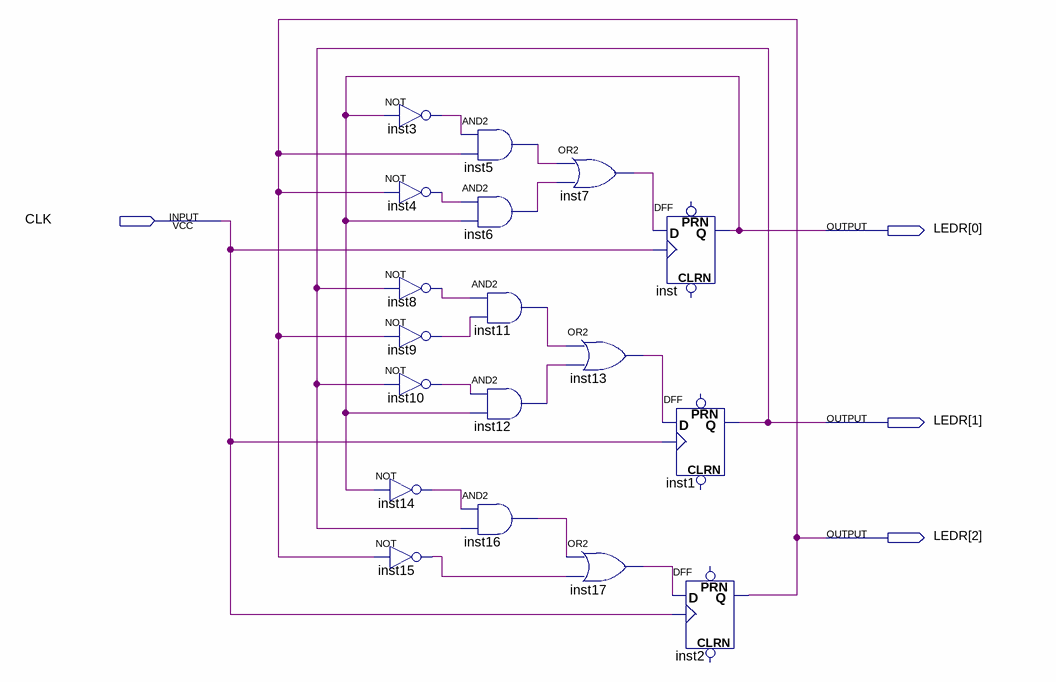
[diagram p0: schematic sheet]
// Quartus schematic lab22.bdf as structural Verilog: 18 symbols, 4 pins
module lab22 (
  input  CLK,
  output [2:0] LEDR
);

  wire inst3_out, inst4_out, inst5_out, inst6_out, inst7_out, inst8_out, inst9_out, inst10_out, inst11_out,
       inst12_out, inst13_out, inst14_out, inst15_out, inst16_out, inst17_out;

  not inst3 (inst3_out, LEDR[0]);
  not inst4 (inst4_out, LEDR[2]);
  not inst8 (inst8_out, LEDR[1]);
  not inst9 (inst9_out, LEDR[2]);
  not inst10 (inst10_out, LEDR[1]);
  not inst14 (inst14_out, LEDR[0]);
  not inst15 (inst15_out, LEDR[2]);
  and inst5 (inst5_out, inst3_out, LEDR[2]);
  and inst6 (inst6_out, inst4_out, LEDR[0]);
  and inst11 (inst11_out, inst8_out, inst9_out);
  and inst12 (inst12_out, inst10_out, LEDR[0]);
  and inst16 (inst16_out, inst14_out, LEDR[1]);
  or inst7 (inst7_out, inst5_out, inst6_out);
  or inst13 (inst13_out, inst11_out, inst12_out);
  or inst17 (inst17_out, inst16_out, inst15_out);
  DFF inst (.CLK(CLK), .D(inst7_out), .Q(LEDR[0]));  // open: CLRN, PRN
  DFF inst1 (.CLK(CLK), .D(inst13_out), .Q(LEDR[1]));  // open: CLRN, PRN
  DFF inst2 (.CLK(CLK), .D(inst17_out), .Q(LEDR[2]));  // open: CLRN, PRN
endmodule
